# Altium schematic sheet DM1097_MODULE_HSPEED.SchDoc: =project_title
size Tabloid; CompanyName: Luxonis Holding; Organization: Luxonis Holding; Address1: 1925 Harmony Park Drive; Address2: Westminster, CO; Address3: 80234; Address4: United States; SheetNumber: 9; SheetTotal: 17
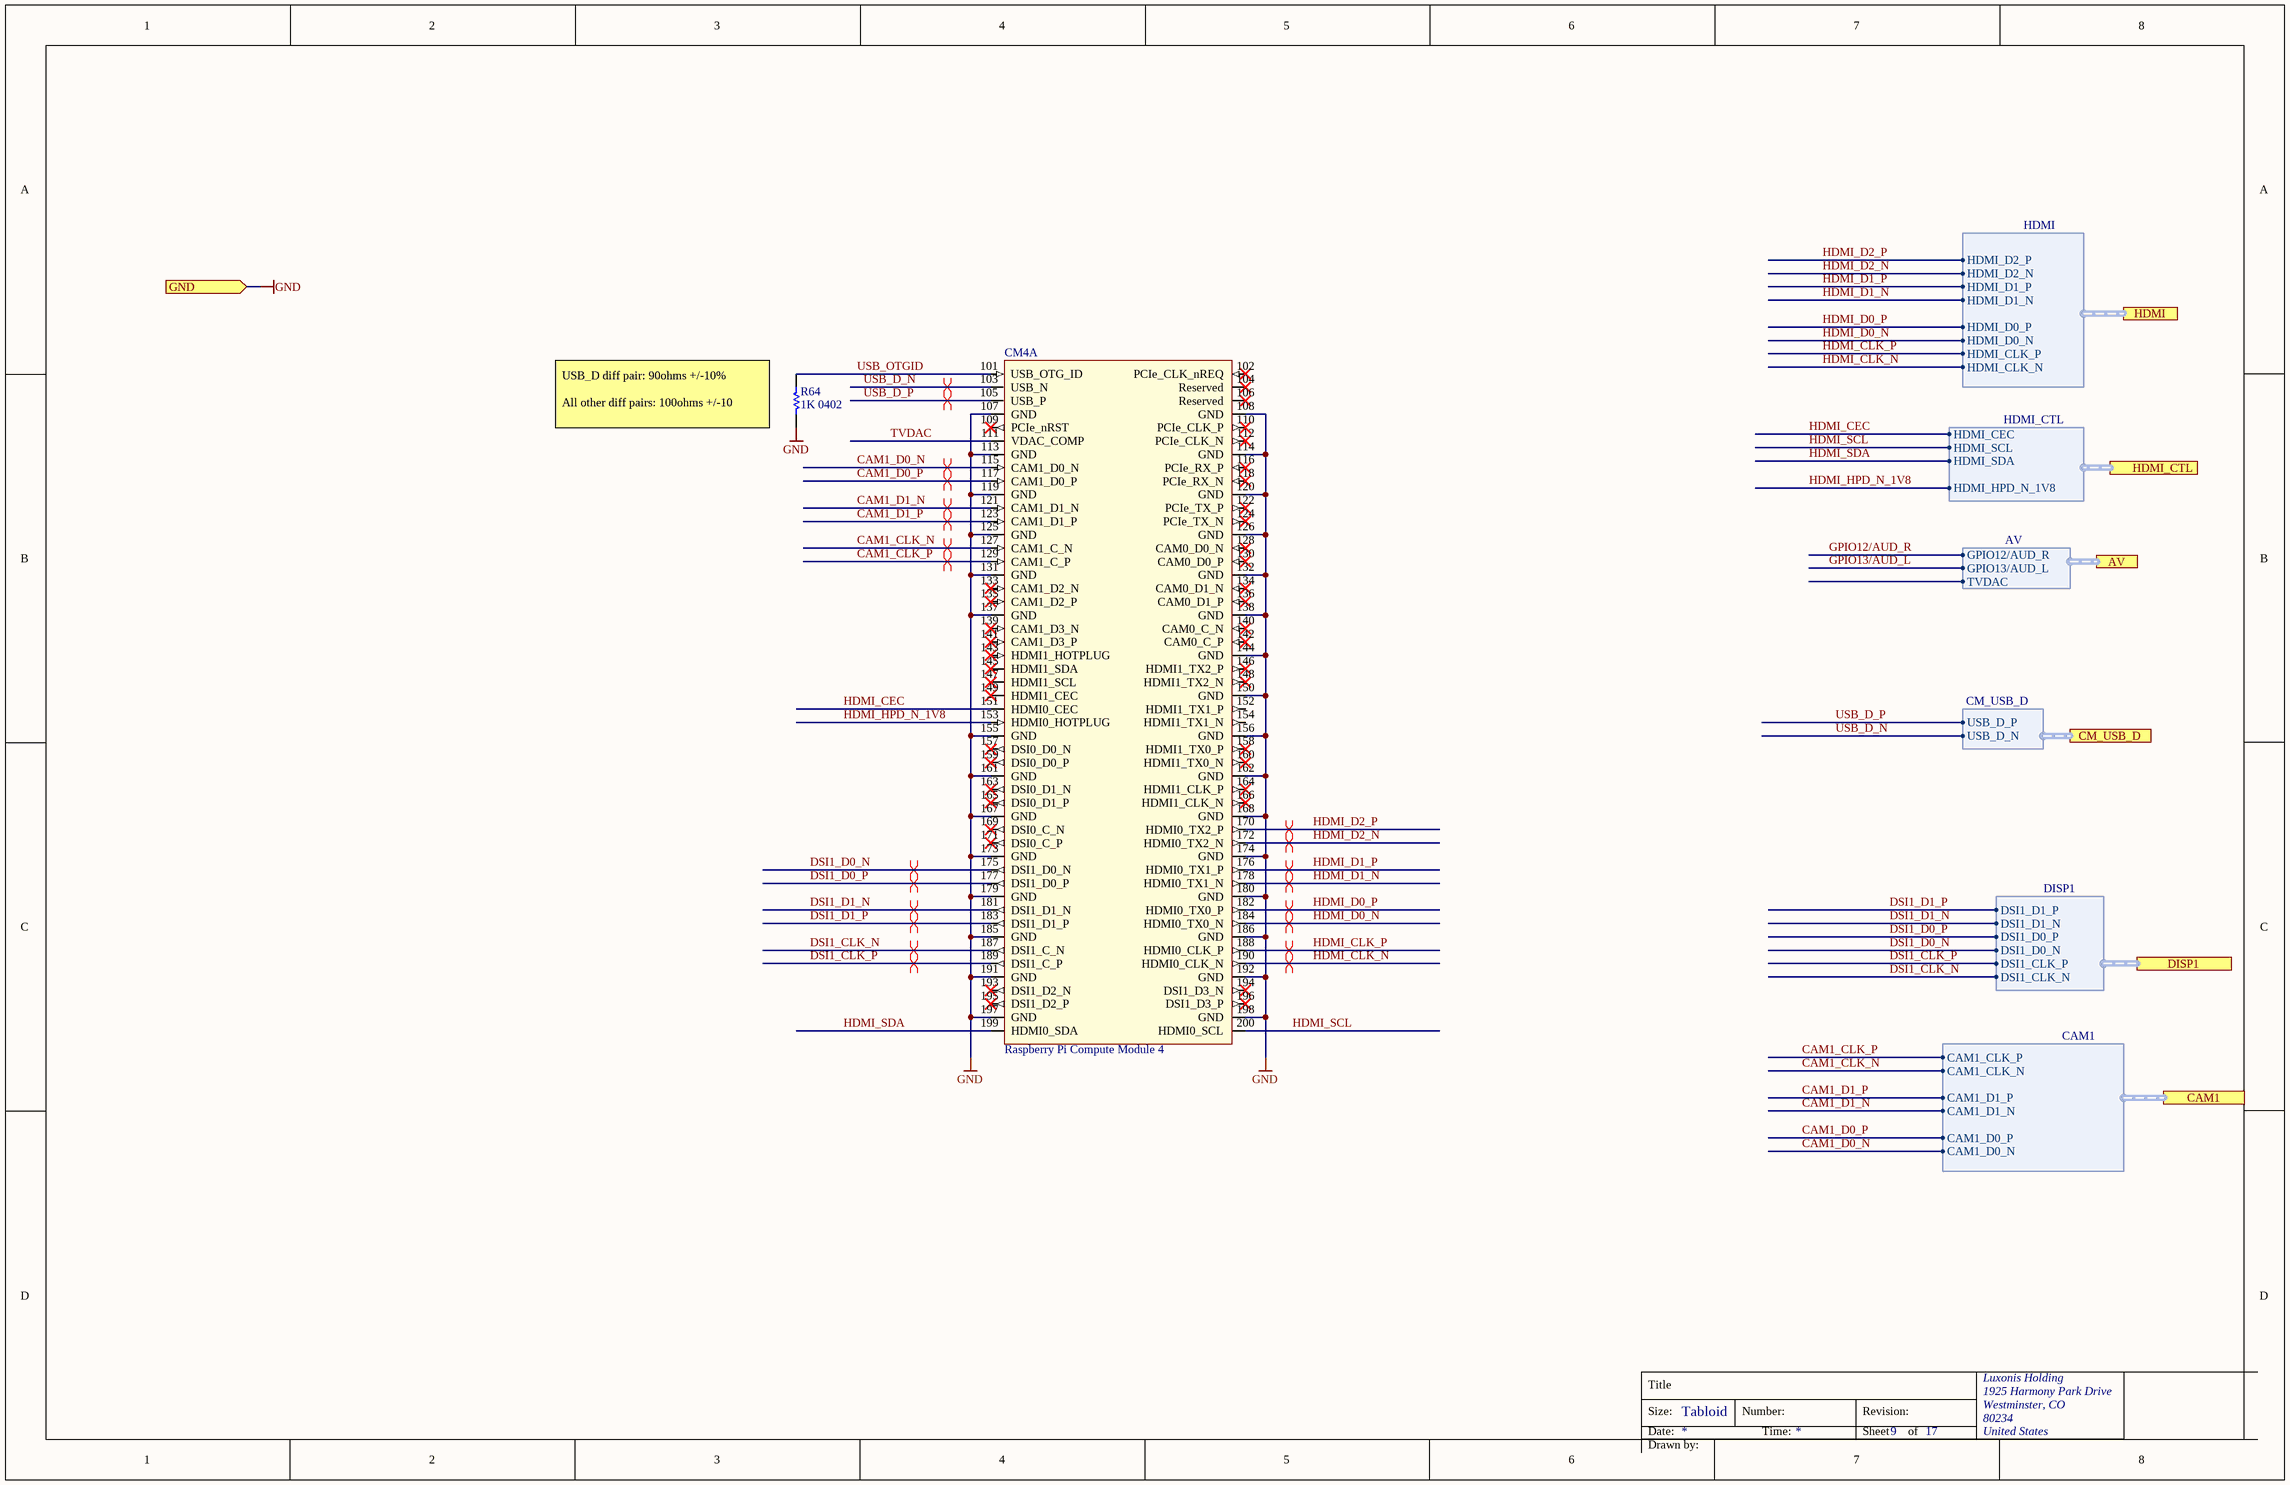
[diagram p0: DM1097_MODULE_HSPEED.SchDoc]

## Parts
CM4  Raspberry Pi Compute Module 4  [CM4-DF40HC(3.0)-100DS-0.4v_3mm_1.5mm]  (part A of 2)
R64  1K 0402  [RESC0402(1005)_N]

## Ports
AV (harness AV), CAM1 (harness CAM1), CM_USB_D (harness CM_USB_D), DISP1 (harness DISP1), GND (in), HDMI (harness HDMI), HDMI_CTL (harness HDMI_CTL)

## Harnesses
HDMI: HDMI_CLK_N, HDMI_CLK_P, HDMI_D0_N, HDMI_D0_P, HDMI_D1_N, HDMI_D1_P, HDMI_D2_N, HDMI_D2_P
CM_USB_D: USB_D_P, USB_D_N
CAM1: CAM1_CLK_P, CAM1_CLK_N, CAM1_D1_P, CAM1_D1_N, CAM1_D0_P, CAM1_D0_N
DISP1: DSI1_D0_P, DSI1_D0_N, DSI1_CLK_P, DSI1_CLK_N, DSI1_D1_P, DSI1_D1_N
HDMI_CTL: HDMI_CEC, HDMI_SCL, HDMI_SDA, HDMI_HPD_N_1V8
AV: GPIO12/AUD_R, GPIO13/AUD_L, TVDAC

## Nets
GND: CM4.107(GND) CM4.108(GND) CM4.113(GND) CM4.114(GND) CM4.119(GND) CM4.120(GND) CM4.125(GND) CM4.126(GND) CM4.131(GND) CM4.132(GND) CM4.137(GND) CM4.138(GND) CM4.144(GND) CM4.150(GND) CM4.155(GND) CM4.156(GND) CM4.161(GND) CM4.162(GND) CM4.167(GND) CM4.168(GND) CM4.173(GND) CM4.174(GND) CM4.179(GND) CM4.180(GND) CM4.185(GND) CM4.186(GND) CM4.191(GND) CM4.192(GND) CM4.197(GND) CM4.198(GND) R64.1 ; port GND
CAM1_CLK_N: CM4.127(CAM1_C_N) ; port CAM1.CAM1_CLK_N
CAM1_CLK_P: CM4.129(CAM1_C_P) ; port CAM1.CAM1_CLK_P
CAM1_D0_N: CM4.115(CAM1_D0_N) ; port CAM1.CAM1_D0_N
CAM1_D0_P: CM4.117(CAM1_D0_P) ; port CAM1.CAM1_D0_P
CAM1_D1_N: CM4.121(CAM1_D1_N) ; port CAM1.CAM1_D1_N
CAM1_D1_P: CM4.123(CAM1_D1_P) ; port CAM1.CAM1_D1_P
DSI1_CLK_N: CM4.187(DSI1_C_N) ; port DISP1.DSI1_CLK_N
DSI1_CLK_P: CM4.189(DSI1_C_P) ; port DISP1.DSI1_CLK_P
DSI1_D0_N: CM4.175(DSI1_D0_N) ; port DISP1.DSI1_D0_N
DSI1_D0_P: CM4.177(DSI1_D0_P) ; port DISP1.DSI1_D0_P
DSI1_D1_N: CM4.181(DSI1_D1_N) ; port DISP1.DSI1_D1_N
DSI1_D1_P: CM4.183(DSI1_D1_P) ; port DISP1.DSI1_D1_P
GPIO12/AUD_R: port AV.GPIO12/AUD_R
GPIO13/AUD_L: port AV.GPIO13/AUD_L
HDMI_CEC: CM4.151(HDMI0_CEC) ; port HDMI_CTL.HDMI_CEC
HDMI_CLK_N: CM4.190(HDMI0_CLK_N) ; port HDMI.HDMI_CLK_N
HDMI_CLK_P: CM4.188(HDMI0_CLK_P) ; port HDMI.HDMI_CLK_P
HDMI_D0_N: CM4.184(HDMI0_TX0_N) ; port HDMI.HDMI_D0_N
HDMI_D0_P: CM4.182(HDMI0_TX0_P) ; port HDMI.HDMI_D0_P
HDMI_D1_N: CM4.178(HDMI0_TX1_N) ; port HDMI.HDMI_D1_N
HDMI_D1_P: CM4.176(HDMI0_TX1_P) ; port HDMI.HDMI_D1_P
HDMI_D2_N: CM4.172(HDMI0_TX2_N) ; port HDMI.HDMI_D2_N
HDMI_D2_P: CM4.170(HDMI0_TX2_P) ; port HDMI.HDMI_D2_P
HDMI_HPD_N_1V8: CM4.153(HDMI0_HOTPLUG) ; port HDMI_CTL.HDMI_HPD_N_1V8
HDMI_SCL: CM4.200(HDMI0_SCL) ; port HDMI_CTL.HDMI_SCL
HDMI_SDA: CM4.199(HDMI0_SDA) ; port HDMI_CTL.HDMI_SDA
TVDAC: CM4.111(VDAC_COMP)
USB_D_N: CM4.103(USB_N) ; port CM_USB_D.USB_D_N
USB_D_P: CM4.105(USB_P) ; port CM_USB_D.USB_D_P
USB_OTGID: CM4.101(USB_OTG_ID) R64.2

Not connected (* = marked no-connect by the designer): CM4 102(PCIe_CLK_nREQ)* 104(Reserved)* 106(Reserved)* 109(PCIe_nRST)* 110(PCIe_CLK_P)* 112(PCIe_CLK_N)* 116(PCIe_RX_P)* 118(PCIe_RX_N)* 122(PCIe_TX_P)* 124(PCIe_TX_N)* 128(CAM0_D0_N)* 130(CAM0_D0_P)* 133(CAM1_D2_N)* 134(CAM0_D1_N)* 135(CAM1_D2_P)* 136(CAM0_D1_P)* 139(CAM1_D3_N)* 140(CAM0_C_N)* 141(CAM1_D3_P)* 142(CAM0_C_P)* 143(HDMI1_HOTPLUG)* 145(HDMI1_SDA)* 146(HDMI1_TX2_P)* 147(HDMI1_SCL)* 148(HDMI1_TX2_N)* 149(HDMI1_CEC)* 152(HDMI1_TX1_P) 154(HDMI1_TX1_N) 157(DSI0_D0_N)* 158(HDMI1_TX0_P)* 159(DSI0_D0_P)* 160(HDMI1_TX0_N)* 163(DSI0_D1_N)* 164(HDMI1_CLK_P)* 165(DSI0_D1_P)* 166(HDMI1_CLK_N)* 169(DSI0_C_N)* 171(DSI0_C_P)* 193(DSI1_D2_N)* 194(DSI1_D3_N)* 195(DSI1_D2_P)* 196(DSI1_D3_P)*

## Layout directives
differential pair; differential pair class 90ohm: USB_D_N, USB_D_P
differential pair; differential pair class 100ohm: CAM1_CLK_N, CAM1_CLK_P, CAM1_D0_N, CAM1_D0_P, CAM1_D1_N, CAM1_D1_P, DSI1_CLK_N, DSI1_CLK_P, DSI1_D0_N, DSI1_D0_P, DSI1_D1_N, DSI1_D1_P, HDMI_CLK_N, HDMI_CLK_P, HDMI_D0_N, HDMI_D0_P, HDMI_D1_N, HDMI_D1_P, HDMI_D2_N, HDMI_D2_P

## Notes on the sheet
- (near R64) USB_D diff pair: 90ohms +/-10%
  All other diff pairs: 100ohms +/-10
- Title
- Size:
- Date:
- Tabloid
- Number:
- Time:
- Revision:
- Sheet
- of
- Drawn by:

## Library data of the parts
CM4 = CM4: Raspberry Pi Compute Module 4 / Two receptacle 100-pin connectors; Manufacturer 1: Hirose; Manufacturer Part Number 1: DF40HC(3.0)-100DS-0.4V(51; ComponentLink1Description: https://datasheet.ciiva.com/46636/ed-df40-20140305-46636517.pdf?src-supplier=Digi-Key; ComponentLink1URL: https://datasheet.ciiva.com/46636/ed-df40-20140305-46636517.pdf?src-supplier=Digi-Key; ComponentLink2Description: https://datasheet.ciiva.com/18562/ed-df40-20140305-18562189.pdf?src-supplier=Digi-Key; ComponentLink2URL: https://datasheet.ciiva.com/18562/ed-df40-20140305-18562189.pdf?src-supplier=Digi-Key; ComponentLink3Description: https://datasheet.ciiva.com/13559/ed-df40-20140305-13559540.pdf?src-supplier=Mouser; ComponentLink3URL: https://datasheet.ciiva.com/13559/ed-df40-20140305-13559540.pdf?src-supplier=Mouser; ComponentLink4Description: https://datasheet.ciiva.com/18562/ed-df40-20140305-18562462.pdf?src-supplier=Digi-Key; ComponentLink4URL: https://datasheet.ciiva.com/18562/ed-df40-20140305-18562462.pdf?src-supplier=Digi-Key
R64 = RC0402FR-071KL: RES SMD 1K OHM 1% 1/16W 0402 1 kOhms ±1% 0.063W, 1/16W Chip Resistor 0402 (1005 Metric) Moisture Resistant Thick Film; Manufacturer 1: Yageo; Temperature Coefficient: 100ppm/°C; Power Rating: 62.5mW; Voltage Rating (DC): 50V; Resistance: 1kR; Manufacturer Part Number 1: RC0402FR-071KL; RoHS: Yes; Number of Pins: 2; Case Code (Imperial): 0402; Case Code (Metric): 1005; Min Operating Temperature: -55°C; Max Operating Temperature: 155°C; Packaging: Tape and Reel; Composition: Thick Film; Voltage Rating: 50V; Military Standard: Not; Termination: SMD/SMT; Length: 1mm; Height: 0.32mm; Width: 0.5mm; Depth: 0.5mm; Lead Free: Lead Free; REACH SVHC: Unknown; ComponentLink1URL: https://datasheet.ciiva.com/11819/0900766b80c66297-11819477.pdf?src-supplier=RSComponents; ComponentLink1Description: https://datasheet.ciiva.com/11819/0900766b80c66297-11819477.pdf?src-supplier=RSComponents; ComponentLink2URL: https://datasheet.ciiva.com/12666/pyu-rc0402-51-rohs-l-6-r-12666741.pdf?src-supplier=Mouser; ComponentLink2Description: https://datasheet.ciiva.com/12666/pyu-rc0402-51-rohs-l-6-r-12666741.pdf?src-supplier=Mouser; ComponentLink3URL: https://datasheet.ciiva.com/17063/pyu-rc0402-51-rohs-l-6-r-17063193.pdf?src-supplier=Future+Electronics; ComponentLink3Description: https://datasheet.ciiva.com/17063/pyu-rc0402-51-rohs-l-6-r-17063193.pdf?src-supplier=Future+Electronics; ComponentLink4URL: https://datasheet.ciiva.com/22747/1018594-22747513.pdf?src-supplier=Element14; ComponentLink4Description: https://datasheet.ciiva.com/22747/1018594-22747513.pdf?src-supplier=Element14; ComponentLink5URL: https://datasheet.ciiva.com/7849/1018594-7849869.pdf?src-supplier=Element14; ComponentLink5Description: https://datasheet.ciiva.com/7849/1018594-7849869.pdf?src-supplier=Element14; ComponentLink6URL: https://datasheet.ciiva.com/7983/1018594-7983502.pdf?src-supplier=Element14; ComponentLink6Description: https://datasheet.ciiva.com/7983/1018594-7983502.pdf?src-supplier=Element14; ComponentLink7URL: https://datasheet.ciiva.com/7849/1018594-7849871.pdf?src-supplier=Element14; ComponentLink7Description: https://datasheet.ciiva.com/7849/1018594-7849871.pdf?src-supplier=Element14; Supplier 1: Digi-Key; Stock 1: 60695854; Pricing 1: 1=0.10000, 10=0.01600, 100=0.00670, 1000=0.00301, 2500=0.00261, 5000=0.00215 (USD); Case/Package: 0402; Tolerance: 1%; Supplier Part Number 1: 311-1.00KLRCT-ND